# EAGLE schematic g3d2_ctrl (EAGLE 5.11)
RIPPLE: 500 mA
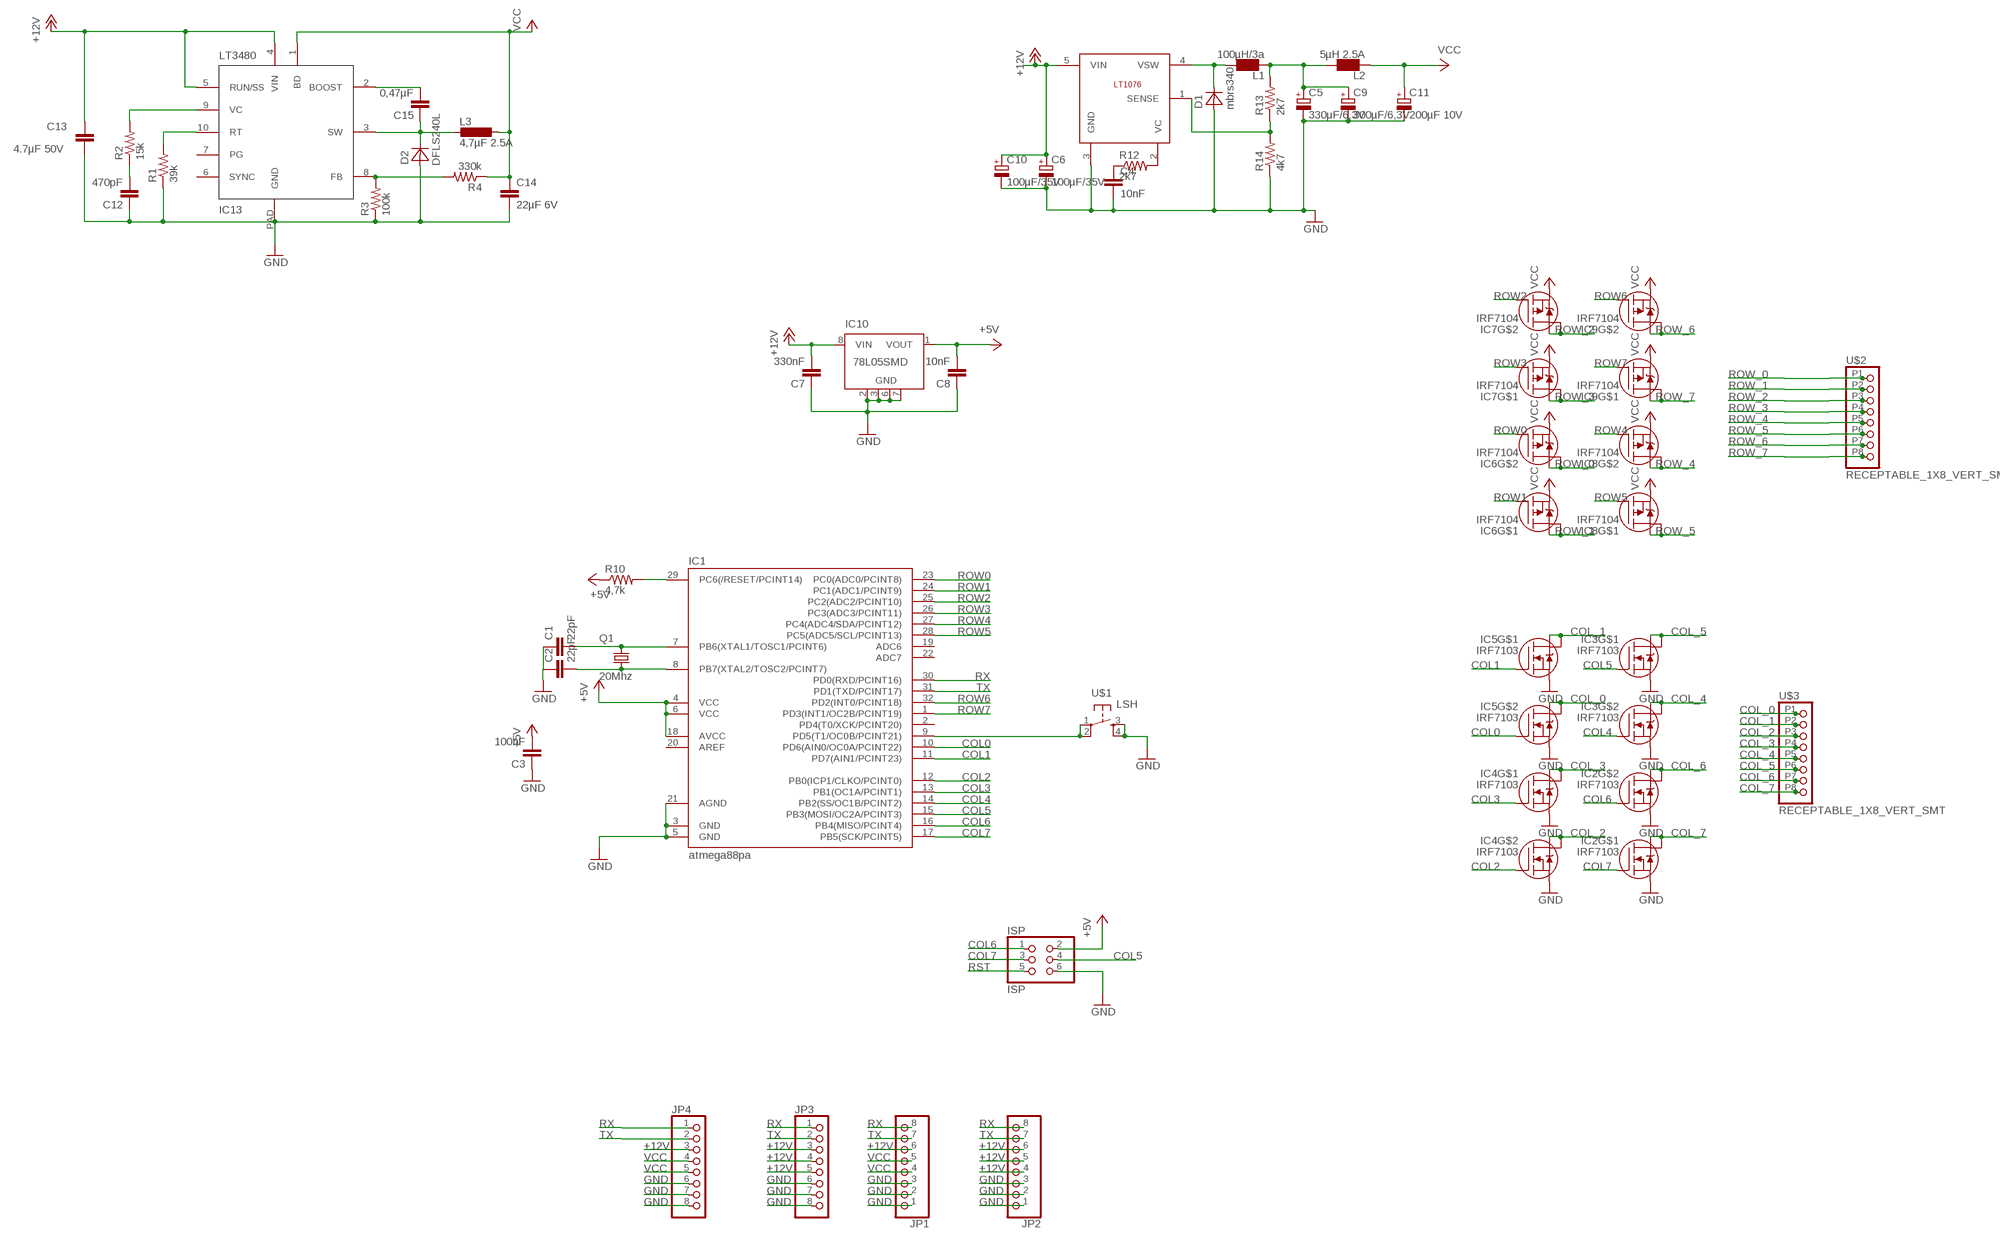
[diagram p0: schematic, sheet 1]

## Parts
C1  22pF  CAP0805  [0805]
C2  22pF  CAP0805  [0805]
C3  100nF  CAP0805  [0805]
C4  10nF  CAP0805  [0805]
C5  330µF/6,3V  CPOL-EUD  [PANASONIC_D]
C6  100µF/35V  CPOL-EUD  [PANASONIC_D]
C7  330nF  CAP0805  [0805]
C8  10nF  CAP0805  [0805]
C9  300µF/6,3V  CPOL-EUD  [PANASONIC_D]
C10  100µF/35V  CPOL-EUD  [PANASONIC_D]
C11  200µF 10V  CPOL-EUSMCD  [SMC_D]
C12  470pF  CAP0805  [0805]
C13  4.7µF 50V  CAP1210  [1210]
C14  22µF 6V  CAP1210  [1210]
C15  0,47µF  CAP0805  [0805]
D1  mbrs340  MBRS340  [DO214AB]
D2  DFLS240L  [POWERDI_123]
IC1  atmega88pa  MEGA48/88/168-AU  [TQFP32-08]
IC2  IRF7103  [SO8-2]
IC3  IRF7103  [SO8-2]
IC4  IRF7103  [SO8-2]
IC5  IRF7103  [SO8-2]
IC6  IRF7104  [SO8-2]
IC7  IRF7104  [SO8-2]
IC8  IRF7104  [SO8-2]
IC9  IRF7104  [SO8-2]
IC10  78L05SMD  [SO08]
IC12  LT1076  [Q5-DD]
IC13  LT3480  [MSOP10-PAD]
ISP  ISP  PINHD-2X03_2.54  [2X03]
JP1  PINHD-1X08_2.54-SMD-90°  [1X08SMD/90]
JP2  PINHD-1X08_2.54-SMD-90°  [1X08SMD/90]
JP3  PINHD-1X08_2.54-SMD-90°  [1X08SMD/90]
JP4  PINHD-1X08_2.54-SMD-90°  [1X08SMD/90]
L1  100µH/3a  L-PISR  [PISR]
L2  5µH 2.5A  L-PISG  [PISG]
L3  4,7µF 2.5A  DO3316P  [DO3316P]
Q1  20Mhz  X22-OSCILLATOR  [X22]
R1  39k  RESISTOR  [0805]
R2  15k  RESISTOR  [0805]
R3  100k  RESISTOR  [0805]
R4  330k  RESISTOR  [0805]
R10  4,7k  RESISTOR  [0805]
R12  2k7  RESISTOR  [0805]
R13  2k7  RESISTOR  [0805]
R14  4k7  RESISTOR  [0805]
U$1  LSH  [LSH]
U$2  RECEPTABLE_1X8_VERT_SMT  [RECEPTABLE_1X8_VERT_SMT]
U$3  RECEPTABLE_1X8_VERT_SMT  [RECEPTABLE_1X8_VERT_SMT]

## Nets
+5V: C3.2 C8.2 IC1.4(VCC) IC1.6(VCC) IC1.18(AVCC) IC10.1(VOUT) ISP.2 R10.1
+12V: C6.+ C7.2 C10.+ C13.1 IC10.8(VIN) IC12.5(VIN) IC13.4(VIN) IC13.5(RUN/SS) JP1.6 JP2.4 JP2.5 JP2.6 JP3.3 JP3.4 JP3.5 JP4.3
COL0: IC1.10(PD6(AIN0/OC0A/PCINT22)) IC5.4(G)
COL1: IC1.11(PD7(AIN1/PCINT23)) IC5.2(G)
COL2: IC1.12(PB0(ICP1/CLKO/PCINT0)) IC4.4(G)
COL3: IC1.13(PB1(OC1A/PCINT1)) IC4.2(G)
COL4: IC1.14(PB2(SS/OC1B/PCINT2)) IC3.4(G)
COL5: IC1.15(PB3(MOSI/OC2A/PCINT3)) IC3.2(G) ISP.4
COL6: IC1.16(PB4(MISO/PCINT4)) IC2.4(G) ISP.1
COL7: IC1.17(PB5(SCK/PCINT5)) IC2.2(G) ISP.3
COL_0: IC5.5(D) IC5.6(D) U$3.P1
COL_1: IC5.7(D) IC5.8(D) U$3.P2
COL_2: IC4.5(D) IC4.6(D) U$3.P3
COL_3: IC4.7(D) IC4.8(D) U$3.P4
COL_4: IC3.5(D) IC3.6(D) U$3.P5
COL_5: IC3.7(D) IC3.8(D) U$3.P6
COL_6: IC2.5(D) IC2.6(D) U$3.P7
COL_7: IC2.7(D) IC2.8(D) U$3.P8
GND: C1.1 C2.1 C3.1 C4.2 C5.- C6.- C7.1 C8.1 C9.- C10.- C11.- C12.1 C13.2 C14.2 D1.A D2.A IC1.3(GND) IC1.5(GND) IC1.21(AGND) IC2.1(S) IC2.3(S) IC3.1(S) IC3.3(S) IC4.1(S) IC4.3(S) IC5.1(S) IC5.3(S) IC10.2(GND) IC10.3(GND) IC10.6(GND) IC10.7(GND) IC12.3(GND) IC13.PAD(GND) ISP.6 JP1.1 JP1.2 JP1.3 JP2.1 JP2.2 JP2.3 JP3.6 JP3.7 JP3.8 JP4.6 JP4.7 JP4.8 R1.1 R3.1 R14.1 U$1.3 U$1.4
N$1: C2.2 IC1.8(PB7(XTAL2/TOSC2/PCINT7)) Q1.1
N$2: C5.+ C9.+ L1.P$2 L2.P$1 R13.2
N$3: C1.2 IC1.7(PB6(XTAL1/TOSC1/PCINT6)) Q1.3
N$5: IC12.1(SENSE) R13.1 R14.2
N$6: IC13.10(RT) R1.2
N$7: IC1.9(PD5(T1/OC0B/PCINT21)) U$1.1 U$1.2
N$8: C15.1 D2.K(C) IC13.3(SW) L3.1
N$9: C12.2 R2.1
N$10: IC13.9(VC) R2.2
N$12: IC13.8(FB) R3.2 R4.2
N$15: C15.2 IC13.2(BOOST)
N$17: C4.1 R12.1
N$18: IC12.2(VC) R12.2
N$19: D1.K(C) IC12.4(VSW) L1.P$1
ROW0: IC1.23(PC0(ADC0/PCINT8)) IC6.4(G)
ROW1: IC1.24(PC1(ADC1/PCINT9)) IC6.2(G)
ROW2: IC1.25(PC2(ADC2/PCINT10)) IC7.4(G)
ROW3: IC1.26(PC3(ADC3/PCINT11)) IC7.2(G)
ROW4: IC1.27(PC4(ADC4/SDA/PCINT12)) IC8.4(G)
ROW5: IC1.28(PC5(ADC5/SCL/PCINT13)) IC8.2(G)
ROW6: IC1.32(PD2(INT0/PCINT18)) IC9.4(G)
ROW7: IC1.1(PD3(INT1/OC2B/PCINT19)) IC9.2(G)
ROW_0: IC6.5(D) IC6.6(D) U$2.P1
ROW_1: IC6.7(D) IC6.8(D) U$2.P2
ROW_2: IC7.5(D) IC7.6(D) U$2.P3
ROW_3: IC7.7(D) IC7.8(D) U$2.P4
ROW_4: IC8.5(D) IC8.6(D) U$2.P5
ROW_5: IC8.7(D) IC8.8(D) U$2.P6
ROW_6: IC9.5(D) IC9.6(D) U$2.P7
ROW_7: IC9.7(D) IC9.8(D) U$2.P8
RST: IC1.29(PC6(/RESET/PCINT14)) ISP.5 R10.2
RX: IC1.30(PD0(RXD/PCINT16)) JP1.8 JP2.8 JP3.1 JP4.1
TX: IC1.31(PD1(TXD/PCINT17)) JP1.7 JP2.7 JP3.2 JP4.2
VCC: C11.+ C14.1 IC6.1(S) IC6.3(S) IC7.1(S) IC7.3(S) IC8.1(S) IC8.3(S) IC9.1(S) IC9.3(S) IC13.1(BD) JP1.4 JP1.5 JP4.4 JP4.5 L2.P$2 L3.2 R4.1
Unconnected: IC1.2(PD4(T0/XCK/PCINT20)) IC1.19(ADC6) IC1.20(AREF) IC1.22(ADC7) IC10.4(NC) IC10.5(NC) IC13.6(SYNC) IC13.7(PG)

## Library data of the parts
C1-C4 C7 C8 C12-C15 = SparkFun:CAP: Capacitor Standard 0603 ceramic capacitor, and 0.1" leaded capacitor.
C5 C6 C9-C11 = rcl:CPOL-EU: POLARIZED CAPACITOR, European symbol
D1 = seb:MBRS340
D2 = seb:DFLS240L
IC1 = avr-4:MEGA48/88/168
IC2-IC5 = irf-2:IRF7103: HEXFET® Power MOSFET Adavanced Process Technology Ultra Low On-Resistance Dual N-Channel MOSFET Surface Mount Available in Tape & Reel Dynamic dv/dt Rating Fast Switching Please connect both Drain-Pins of each FET for thermal Reasons! (Pin 5 with Pin 6, 7 with 8)
IC6-IC9 = irf-2:IRF7104: HEXFET® Power MOSFET Adavanced Process Technology Ultra Low On-Resistance Dual P-Channel MOSFET Surface Mount Available in Tape & Reel Dynamic dv/dt Rating Fast Switching Please connect both Drain-Pins of each FET for thermal Reasons! (Pin 5 with Pin 6, 7 with 8)
IC10 = linear:78L*SMD: Positive VOLTAGE REGULATOR
IC12 = seb:LT1076
IC13 = seb:LT3480
ISP = pinhead-2:PINHD-2X03: PIN HEADER
JP1-JP4 = pinhead-2:PINHD-1X08: PIN HEADER
L1 = seb:L-PISR
L2 = seb:L-PISG
L3 = inductor-coilcraft:DO3316P: COILCRAFT; OC_FARNELL: unknown; OC_NEWARK: unknown
Q1 = seb:X22-OSCILLATOR
R1-R4 R10 R12-R14 = SparkFun:RESISTOR: Resistor Basic schematic elements and footprints for 0603, 1206, and PTH 1/10th watt (small) resistors.
U$1 = switch-tact:LSH
U$2 U$3 = seb:RECEPTABLE_1X8_VERT_SMT